# Altium project ADC_board.PrjPcb
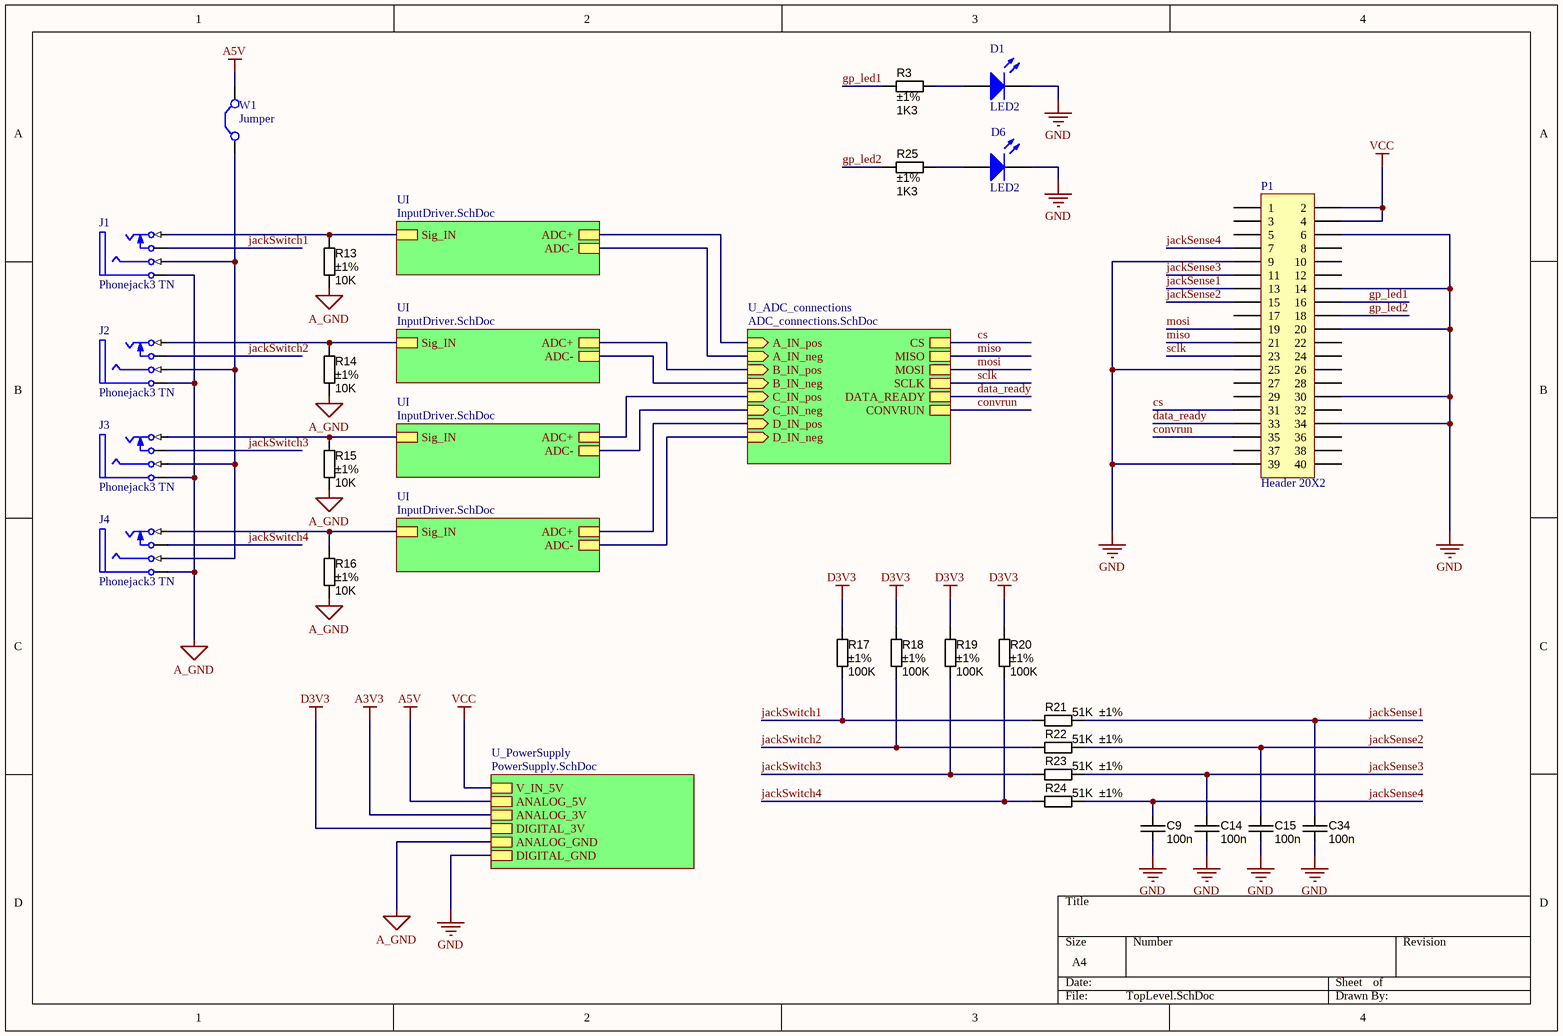
[diagram p0: TopLevel.SchDoc]
4 sheets, 106 parts. Net scope: hierarchical (ports join the sheet entries above them; power ports are global).
Board file: adc_pcb_board.PcbDoc
Sheets:
  TopLevel.SchDoc
    U_ADC_connections = ADC_connections.SchDoc
    UI = InputDriver.SchDoc
    UI = InputDriver.SchDoc
    UI = InputDriver.SchDoc
    UI = InputDriver.SchDoc
    U_PowerSupply = PowerSupply.SchDoc

## Sheet TopLevel.SchDoc
size A4

### Parts
C9  value 100n  [CAPC2012X135N]  (hidden comment: approved sub OK)
C14  value 100n  [CAPC2012X135N]  (hidden comment: approved sub OK)
C15  value 100n  [CAPC2012X135N]  (hidden comment: approved sub OK)
C34  value 100n  [CAPC2012X135N]  (hidden comment: approved sub OK)
D1  LED2  [3.2X1.6X1.1]
D6  LED2  [3.2X1.6X1.1]
J1  Phonejack3 TN  [SJ1-352XN Female Jack]
J2  Phonejack3 TN  [SJ1-352XN Female Jack]
J3  Phonejack3 TN  [SJ1-352XN Female Jack]
J4  Phonejack3 TN  [SJ1-352XN Female Jack]
P1  Header 20X2  [HDR2X20]
R3  value 1K3  Tolerance: ±1%  [RESC2012X70N]  (hidden comment: Thick Film)
R13  value 10K  Tolerance: ±1%  [RESC2012X70N]  (hidden comment: Thick Film)
R14  value 10K  Tolerance: ±1%  [RESC2012X70N]  (hidden comment: Thick Film)
R15  value 10K  Tolerance: ±1%  [RESC2012X70N]  (hidden comment: Thick Film)
R16  value 10K  Tolerance: ±1%  [RESC2012X70N]  (hidden comment: Thick Film)
R17  value 100K  Tolerance: ±1%  [RESC2012X70N]  (hidden comment: Thick Film)
R18  value 100K  Tolerance: ±1%  [RESC2012X70N]  (hidden comment: Thick Film)
R19  value 100K  Tolerance: ±1%  [RESC2012X70N]  (hidden comment: Thick Film)
R20  value 100K  Tolerance: ±1%  [RESC2012X70N]  (hidden comment: Thick Film)
R21  value 51K  Tolerance: ±1%  [RESC2012X70N]  (hidden comment: Thick Film)
R22  value 51K  Tolerance: ±1%  [RESC2012X70N]  (hidden comment: Thick Film)
R23  value 51K  Tolerance: ±1%  [RESC2012X70N]  (hidden comment: Thick Film)
R24  value 51K  Tolerance: ±1%  [RESC2012X70N]  (hidden comment: Thick Film)
R25  value 1K3  Tolerance: ±1%  [RESC2012X70N]  (hidden comment: Thick Film)
W1  Jumper  [HDR1X2]

### Sub-sheets
U_ADC_connections = ADC_connections.SchDoc: A_IN_pos (in), A_IN_neg (in), B_IN_pos (in), B_IN_neg (in), C_IN_pos (in), C_IN_neg (in), D_IN_pos (in), D_IN_neg (in), CS, MISO, MOSI, SCLK, DATA_READY, CONVRUN
U_PowerSupply = PowerSupply.SchDoc: V_IN_5V, ANALOG_5V, ANALOG_3V, DIGITAL_3V, ANALOG_GND, DIGITAL_GND
UI = InputDriver.SchDoc: Sig_IN, ADC+, ADC-
UI = InputDriver.SchDoc: Sig_IN, ADC+, ADC-
UI = InputDriver.SchDoc: Sig_IN, ADC+, ADC-
UI = InputDriver.SchDoc: Sig_IN, ADC+, ADC-

### Nets
A5V: P1.2 P1.4 W1.2(C2) ; sheet U_PowerSupply/V_IN_5V, sheet U_PowerSupply/ANALOG_5V  [also labelled VCC]
A_GND: J1.5(S) J2.5(S) J3.5(S) J4.5(S) R13.2 R14.2 R15.2 R16.2 ; sheet U_PowerSupply/ANALOG_GND
D3V3: R17.1 R18.1 R19.1 R20.1 ; sheet U_PowerSupply/DIGITAL_3V
GND: C9.2 C14.2 C15.2 C34.2 D1.2(K) D6.2(K) P1.6 P1.9 P1.14 P1.20 P1.25 P1.30 P1.34 P1.39 ; sheet U_PowerSupply/DIGITAL_GND
ADC_IN_N: sheet U_ADC_connections/B_IN_neg, sheet UI/ADC-
ADC_IN_N: sheet U_ADC_connections/A_IN_neg, sheet UI/ADC-  [a separate net that carries the same name]
ADC_IN_N: sheet U_ADC_connections/C_IN_neg, sheet UI/ADC-  [a separate net that carries the same name]
ADC_IN_N: sheet U_ADC_connections/D_IN_neg, sheet UI/ADC-  [a separate net that carries the same name]
ADC_IN_P: sheet U_ADC_connections/A_IN_pos, sheet UI/ADC+
ADC_IN_P: sheet U_ADC_connections/B_IN_pos, sheet UI/ADC+  [a separate net that carries the same name]
ADC_IN_P: sheet U_ADC_connections/C_IN_pos, sheet UI/ADC+  [a separate net that carries the same name]
ADC_IN_P: sheet U_ADC_connections/D_IN_pos, sheet UI/ADC+  [a separate net that carries the same name]
convrun: P1.35 ; sheet U_ADC_connections/CONVRUN
cs: P1.31 ; sheet U_ADC_connections/CS
data_ready: P1.33 ; sheet U_ADC_connections/DATA_READY
gp_led1: P1.16 R3.1
gp_led2: P1.18 R25.1
jackSense1: C34.1 P1.13 R21.1
jackSense2: C15.1 P1.15 R22.1
jackSense3: C14.1 P1.11 R23.1
jackSense4: C9.1 P1.7 R24.1
jackSwitch1: J1.2(TN) R17.2 R21.2
jackSwitch2: J2.2(TN) R18.2 R22.2
jackSwitch3: J3.2(TN) R19.2 R23.2
jackSwitch4: J4.2(TN) R20.2 R24.2
miso: P1.21 ; sheet U_ADC_connections/MISO
mosi: P1.19 ; sheet U_ADC_connections/MOSI
sclk: P1.23 ; sheet U_ADC_connections/SCLK
NetD1_1: D1.1(A) R3.2
NetD6_1: D6.1(A) R25.2
NetJ1_1: J1.1(T) R13.1 ; sheet UI/Sig_IN
NetJ1_3: J1.3(R) J2.3(R) J3.3(R) J4.3(R) W1.1(C1)
NetJ2_1: J2.1(T) R14.1 ; sheet UI/Sig_IN
NetJ3_1: J3.1(T) R15.1 ; sheet UI/Sig_IN
NetJ4_1: J4.1(T) R16.1 ; sheet UI/Sig_IN

Not connected (* = marked no-connect by the designer): P1 1 3 5 8 10 12 17 22 24 26 27 28 29 32 36 37 38 40

### Library data of the parts
C9 C14 C15 C34 = CAPC_100n_0805_X7R_100V_10%: Capacitor SMD Cer 100nF 10% 100V X7R 0805; Manufacturer 1: TDK Corporation; Manufacturer Part Number 1: C2012X7R2A104K; Ratings: 100V; X7R; Material: ceramic; SCDType: undef; Package / Case: 0805; Tolerance: ±10%; Supplier 1: Digi-Key; Supplier Part Number 1: 445-1418-1-ND
D1 D6 = LED2: Typical RED, GREEN, YELLOW, AMBER GaAs LED; Published: 8-Jun-2000; LatestRevisionDate: 17-Jul-2002; LatestRevisionNote: Re-released for DXP Platform.; PackageVersion: Feb-2002; PackageReference: 3.2X1.6X1.1; Publisher: Altium Limited; PackageDescription: SM LED; 2 Flat Leads
J1-J4 = Phonejack3 TN: Jack Socket, 1/4" [6.5mm], Thru-Hole, Vertical, 3-Conductor with Tip closed & Ring open; pin to pad: 1>2 2>10 5>1; PackageDocument: 2003; PCB_Layout: Complies with manufacturer's recommendation.; DrillAndSlotSize: Corresponds to nominal value.; Published: 15-Jul-2004; DatasheetDocument: 2003; PackageReference: S1VS_SSB; Publisher: Altium Limited; ComponentLink1Description: Manufacturer Link; ComponentLink1URL: http://www.cliffuk.co.uk/
P1 = Header 20X2: Header, 20-Pin, Dual row; LatestRevisionDate: 17-Jul-2002; LatestRevisionNote: Re-released for DXP Platform.; Publisher: Altium Limited
R3 R25 = RES_1K3_0805_1%: Resistor SMD chip 1.3k Ohm 0.125W 1% 0805; Manufacturer 1: Vishay/Dale; Manufacturer Part Number 1: CRCW08051K30FKEA; Ratings: 1/8W; SCDType: spec; Package / Case: 0805 (2012 metric); Supplier 1: Digi-Key; Supplier Part Number 1: 541-1.30KCCT-ND
R13-R16 = RES_10K_0805_1%: Resistor SMD chip 10k Ohm 0.125W 1% 0805; Manufacturer 1: Vishay/Dale; Manufacturer Part Number 1: CRCW080510K0FKEA; Ratings: 1/8W; SCDType: spec; Package / Case: 0805 (2012 metric); Supplier 1: Digi-Key; Supplier Part Number 1: 541-10.0KCCT-ND; Material: Thick Film
R17-R20 = RES_100K_0805_1%: Resistor SMD chip 100k Ohm 0.125W 1% 0805; Manufacturer 1: Vishay/Dale; Manufacturer Part Number 1: CRCW0805100KFKEA; Ratings: 1/8W; SCDType: spec; Package / Case: 0805 (2012 metric); Supplier 1: Digi-Key; Supplier Part Number 1: 541-100KCCT-ND
R21-R24 = RES_51K_0805_1%: Resistor SMD chip 51k Ohm 0.125W 1% 0805; Manufacturer 1: Yageo; Manufacturer Part Number 1: RC0805FR-0751KL; Ratings: 1/8W; SCDType: spec; Package / Case: 0805 (2012 Metric); Supplier 1: Digi-Key; Supplier Part Number 1: 311-51.0KCRCT-ND
W1 = Jumper: Jumper Wire; Published: 24-Mar-1999; LatestRevisionDate: 17-Jul-2002; LatestRevisionNote: Re-released for DXP Platform.; PackageReference: RAD-0.2; Publisher: Altium Limited; PackageDescription: Radial Cap, Thru-Hole; 2 Leads; 0.2 in Pin Spacing

## Sheet ADC_connections.SchDoc
size A4
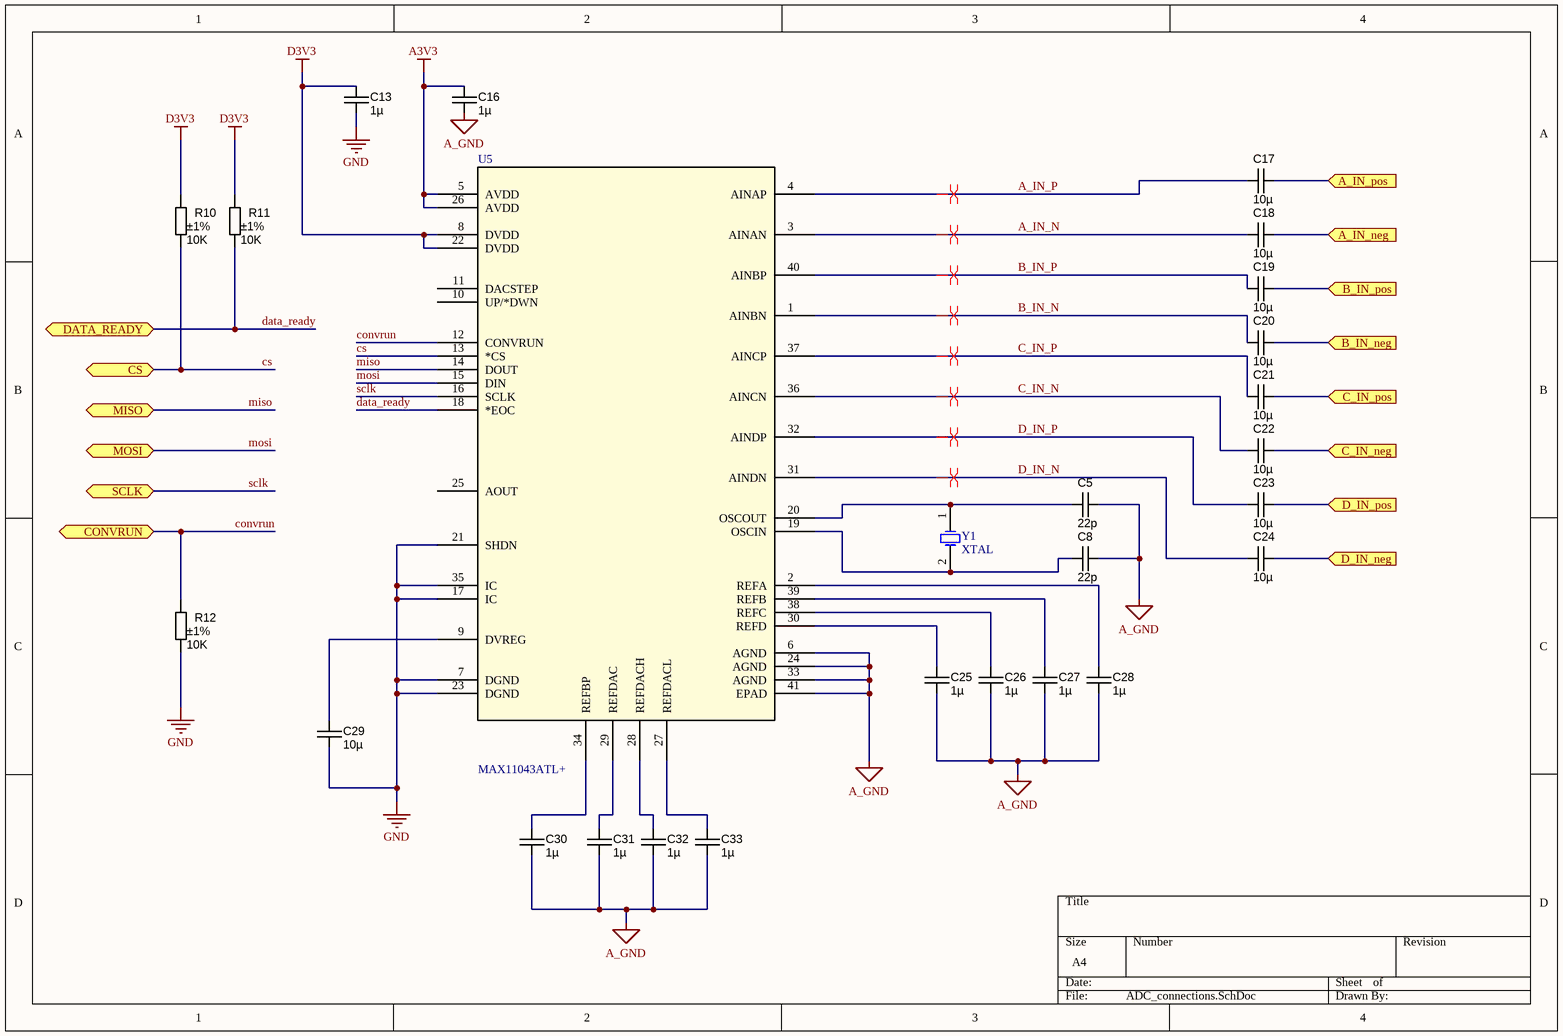
[diagram p1: ADC_connections.SchDoc]

### Parts
C5  value 22p  [CAPC2012X135N]  (hidden comment: approved sub OK)
C8  value 22p  [CAPC2012X135N]  (hidden comment: approved sub OK)
C13  value 1µ  [CAPC2012X135N]  (hidden comment: approved sub OK)
C16  value 1µ  [CAPC2012X135N]  (hidden comment: approved sub OK)
C17  value 10µ  [CAPC2012X135N]  (hidden comment: approved sub OK)
C18  value 10µ  [CAPC2012X135N]  (hidden comment: approved sub OK)
C19  value 10µ  [CAPC2012X135N]  (hidden comment: approved sub OK)
C20  value 10µ  [CAPC2012X135N]  (hidden comment: approved sub OK)
C21  value 10µ  [CAPC2012X135N]  (hidden comment: approved sub OK)
C22  value 10µ  [CAPC2012X135N]  (hidden comment: approved sub OK)
C23  value 10µ  [CAPC2012X135N]  (hidden comment: approved sub OK)
C24  value 10µ  [CAPC2012X135N]  (hidden comment: approved sub OK)
C25  value 1µ  [CAPC2012X135N]  (hidden comment: approved sub OK)
C26  value 1µ  [CAPC2012X135N]  (hidden comment: approved sub OK)
C27  value 1µ  [CAPC2012X135N]  (hidden comment: approved sub OK)
C28  value 1µ  [CAPC2012X135N]  (hidden comment: approved sub OK)
C29  value 10µ  [CAPC2012X135N]  (hidden comment: approved sub OK)
C30  value 1µ  [CAPC2012X135N]  (hidden comment: approved sub OK)
C31  value 1µ  [CAPC2012X135N]  (hidden comment: approved sub OK)
C32  value 1µ  [CAPC2012X135N]  (hidden comment: approved sub OK)
C33  value 1µ  [CAPC2012X135N]  (hidden comment: approved sub OK)
R10  value 10K  Tolerance: ±1%  [RESC2012X70N]  (hidden comment: Thick Film)
R11  value 10K  Tolerance: ±1%  [RESC2012X70N]  (hidden comment: Thick Film)
R12  value 10K  Tolerance: ±1%  [RESC2012X70N]  (hidden comment: Thick Film)
U5  MAX11043ATL+  [21-0141I_T4066-5]
Y1  XTAL  [Quartz Crystal HC-49USSX]

### Ports
A_IN_neg (in), A_IN_pos (in), B_IN_neg (in), B_IN_pos (in), C_IN_neg (in), C_IN_pos (in), CONVRUN, CS, D_IN_neg (in), D_IN_pos (in), DATA_READY, MISO, MOSI, SCLK

### Nets
A3V3: C16.1 U5.5(AVDD) U5.26(AVDD)
A_GND: C5.2 C8.2 C16.2 C25.2 C26.2 C27.2 C28.2 C30.2 C31.2 C32.2 C33.2 U5.6(AGND) U5.24(AGND) U5.33(AGND) U5.41(EPAD)
D3V3: C13.1 R10.1 R11.1 U5.8(DVDD) U5.22(DVDD)
GND: C13.2 C29.1 R12.2 U5.7(DGND) U5.17(IC) U5.21(SHDN) U5.23(DGND) U5.35(IC)
A_IN_N: C18.2 U5.3(AINAN)
A_IN_P: C17.2 U5.4(AINAP)
ADC_IN_N: C20.1 ; port B_IN_neg
ADC_IN_N: C18.1 ; port A_IN_neg  [a separate net that carries the same name]
ADC_IN_N: C22.2 ; port C_IN_neg  [a separate net that carries the same name]
ADC_IN_N: C24.2 ; port D_IN_neg  [a separate net that carries the same name]
ADC_IN_P: C17.1 ; port A_IN_pos
ADC_IN_P: C19.2 ; port B_IN_pos  [a separate net that carries the same name]
ADC_IN_P: C21.2 ; port C_IN_pos  [a separate net that carries the same name]
ADC_IN_P: C23.2 ; port D_IN_pos  [a separate net that carries the same name]
B_IN_N: C20.2 U5.1(AINBN)
B_IN_P: C19.1 U5.40(AINBP)
C_IN_N: C22.1 U5.36(AINCN)
C_IN_P: C21.1 U5.37(AINCP)
convrun: R12.1 U5.12(CONVRUN) ; port CONVRUN
cs: R10.2 U5.13(*CS) ; port CS
D_IN_N: C24.1 U5.31(AINDN)
D_IN_P: C23.1 U5.32(AINDP)
data_ready: R11.2 U5.18(*EOC) ; port DATA_READY
miso: U5.14(DOUT) ; port MISO
mosi: U5.15(DIN) ; port MOSI
sclk: U5.16(SCLK) ; port SCLK
NetC5_1: C5.1 U5.20(OSCOUT) Y1.1(OSC1)
NetC8_1: C8.1 U5.19(OSCIN) Y1.2(OSC2)
NetC25_1: C25.1 U5.30(REFD)
NetC26_1: C26.1 U5.38(REFC)
NetC27_1: C27.1 U5.39(REFB)
NetC28_1: C28.1 U5.2(REFA)
NetC29_2: C29.2 U5.9(DVREG)
NetC30_1: C30.1 U5.34(REFBP)
NetC31_1: C31.1 U5.29(REFDAC)
NetC32_1: C32.1 U5.28(REFDACH)
NetC33_1: C33.1 U5.27(REFDACL)

Not connected (* = marked no-connect by the designer): U5 10(UP/*DWN) 11(DACSTEP) 25(AOUT)

### Layout directives
differential pair: A_IN_N, A_IN_P, B_IN_N, B_IN_P, C_IN_N, C_IN_P, D_IN_N, D_IN_P

### Library data of the parts
C5 C8 = CAPC_27p_0805_NP0_50V_5%: Capacitor SMD Cer 22pF 5% 50V NP0 0805; Manufacturer 1: Panasonic - ECG; Manufacturer Part Number 1: ECJ-2VC1H270J; Ratings: 50V; NP0; SCDType: undef; Tolerance: ±5%; Operating Temperature: -55°C ~ 125°C; Package / Case: 0805 (2012 metric); Supplier 1: Digi-Key; Supplier Part Number 1: PCC270CGCT-ND
C13 C16 C25-C28 C30-C33 = CAPC_1u_0805_X7R_16V_10%: Capacitor SMD Cer 1uF 10% 16V X7R 0805; Manufacturer 1: Yageo; Manufacturer Part Number 1: CC0805KKX7R7BB105; Ratings: 16V; X7R; Material: ceramic; SCDType: spec; Package / Case: 0805 (2012 metric); Tolerance: ±10%; Supplier 1: Digi-Key; Supplier Part Number 1: 311-1365-6-ND; RoHS 1: RoHS Compliant; Temperature Coefficient: X7R; ComponentLink1URL: http://www.yageo.com/documents/recent/UPY-GPHC_X7R_6.3V-to-50V_8.pdf; ComponentLink1Description: http://www.yageo.com/documents/recent/UPY-GPHC_X7R_6.3V-to-50V_8.pdf; Supplier 2: Digi-Key; Supplier Part Number 2: 399-1284-6-ND; Manufacturer 2: Kemet; Manufacturer Part Number 2: C0805C105K4RACTU; RoHS 2: RoHS Compliant; ComponentLink2URL: http://www.kemet.com/datasheets&C0805C105K4RACTU; ComponentLink2Description: http://www.kemet.com/datasheets&C0805C105K4RACTU; Supplier 3: Digi-Key; Supplier Part Number 3: 1276-1026-6-ND; Manufacturer 3: Samsung Electro-Mechanics America, Inc; Manufacturer Part Number 3: CL21B105KOFNNNE; RoHS 3: RoHS Compliant; ComponentLink3URL: http://www.samsungsem.com/servlet/FileDownload?type=spec&file=CL21B105KOFNNNE.pdf; ComponentLink3Description: http://www.samsungsem.com/servlet/FileDownload?type=spec&file=CL21B105KOFNNNE.pdf; Supplier 4: Digi-Key; Supplier Part Number 4: 445-1358-6-ND; Manufacturer 4: TDK Corporation; Manufacturer Part Number 4: C2012X7R1C105K125AA; RoHS 4: RoHS Compliant; ComponentLink4URL: http://product.tdk.com/capacitor/mlcc/en/documents/mlcc_commercial_general_en.pdf; ComponentLink4Description: http://product.tdk.com/capacitor/mlcc/en/documents/mlcc_commercial_general_en.pdf
C17-C24 C29 = CAPC_10u_0805_10V: Capacitor SMD Cer 10uF 10% 10V X5R 0805; Manufacturer 1: AVX Corporation; Manufacturer Part Number 1: 0805ZD106KAT2A; Ratings: 10V; X5R; Material: ceramic; SCDType: spec; Package / Case: 0805 (2012 metric); Tolerance: ±10%; Manufacturer 2: Kemet; Manufacturer Part Number 2: C0805C106K8PACTU; Supplier 1: Digi-Key; Supplier Part Number 1: 478-5167-1-ND; ComponentLink1URL: http://www.avx.com/docs/Catalogs/cx5r.pdf; ComponentLink1Description: http://www.avx.com/docs/Catalogs/cx5r.pdf; ComponentLink2URL: http://www.kemet.com/datasheets&C0805C106K8PACTU; ComponentLink2Description: http://www.kemet.com/datasheets&C0805C106K8PACTU; Supplier 2: Digi-Key; Supplier Part Number 2: 399-4925-1-ND
R10-R12 = RES_10K_0805_1%: as R13 on sheet TopLevel; Package / Case: 0805 (2012 metric); Supplier 1: Digi-Key; Supplier Part Number 1: 541-10.0KCCT-ND; Material: Thick Film
U5 = MAX11043ATL+: Imported; Vendor: Maxim Integrated Products; Built_By: EMA_UL_Team; C: Copyright (C) 2015 Accelerated Designs. All rights reserved; Manufacturer_Part_Number: MAX11043ATL+; RefDes: RefDes; Type: DEV; Value: Value
Y1 = XTAL: Crystal Oscillator; Published: 8-Jun-2000; LatestRevisionDate: 17-Jul-2002; LatestRevisionNote: Re-released for DXP Platform.; PackageReference: R38; Publisher: Altium Limited; PackageDescription: Crystal, Thru-Hole; 2 Leads; Body 3.1 x 8.2 mm (Dia.xH)

## Sheet InputDriver.SchDoc
size A4
Used 4 times, as channels UI, UI, UI, UI. Parts and nets are listed once, with the designators drawn on the sheet.
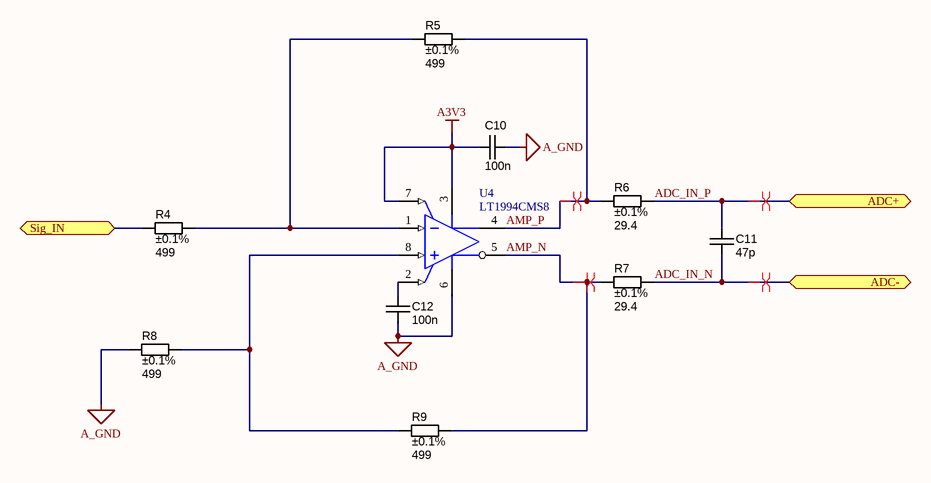
[diagram p2: InputDriver.SchDoc]

### Parts
C10  100n  [CAPC2012X135N]
C11  47p  [CAPC2012X135N]
C12  100n  [CAPC2012X135N]
R4  value 499  Tolerance: ±0.1%  [RESC2012X70N]  (hidden comment: Thick Film)
R5  value 499  Tolerance: ±0.1%  [RESC2012X70N]  (hidden comment: Thick Film)
R6  value 29.4  Tolerance: ±0.1%  [RESC2012X70N]  (hidden comment: Thick Film)
R7  value 29.4  Tolerance: ±0.1%  [RESC2012X70N]  (hidden comment: Thick Film)
R8  value 499  Tolerance: ±0.1%  [RESC2012X70N]  (hidden comment: Thick Film)
R9  value 499  Tolerance: ±0.1%  [RESC2012X70N]  (hidden comment: Thick Film)
U4  LT1994CMS8  [LT-MS8-8_N]

### Ports
ADC+, ADC-, Sig_IN

### Nets
A3V3: C10.1 U4.3(V+) U4.7(~{SHDN})
A_GND: C10.2 C12.2 R8.1 U4.6(V-)
ADC_IN_N: C11.2 R7.2 ; port ADC-
ADC_IN_P: C11.1 R6.2 ; port ADC+
AMP_N: R7.1 R9.2 U4.5(OUT-)
AMP_P: R5.2 R6.1 U4.4(OUT+)
Sig_IN: R4.1 ; port Sig_IN
NetC12_1: C12.1 U4.2(VOCM)
NetR4_2: R4.2 R5.1 U4.1(IN-)
NetR8_2: R8.2 R9.1 U4.8(IN+)

### Channels
UI: designators end in _UI4; ports ADC+=ADC_IN_P ADC-=ADC_IN_N Sig_IN=NetJ1_1
UI: designators end in _UI3; ports ADC+=ADC_IN_P ADC-=ADC_IN_N Sig_IN=NetJ2_1
UI: designators end in _UI2; ports ADC+=ADC_IN_P ADC-=ADC_IN_N Sig_IN=NetJ3_1
UI: designators end in _UI1; ports ADC+=ADC_IN_P ADC-=ADC_IN_N Sig_IN=NetJ4_1

### Layout directives
differential pair: ADC_IN_N, ADC_IN_P, AMP_N_UI, AMP_P_UI

### Library data of the parts
C10 C12 = CAPC_100n_0402_X5R_16V_10%: Capacitor SMD Cer 100nF 10% 16V X5R 0402; Manufacturer 1: AVX Corporation; Manufacturer Part Number 1: 0402YD104KAT2A; Ratings: 16V; X5R; SCDType: spec; Tolerance: ±10%; Operating Temperature: -55°C ~ 125°C; Package / Case: 0402 (1005 Metric); Size / Dimension: 0.039" L x 0.020" W (1.00mm x 0.50mm); Supplier 1: Digi-Key; Supplier Part Number 1: 478-1126-1-ND; ComponentLink1URL: http://www.avx.com/docs/Catalogs/cx5r.pdf; ComponentLink1Description: http://www.avx.com/docs/Catalogs/cx5r.pdf; Supplier 2: Digi-Key; Supplier Part Number 2: 311-1347-1-ND; Manufacturer 2: Yageo; Manufacturer Part Number 2: CC0402KRX5R7BB104; ComponentLink2URL: http://www.yageo.com/documents/recent/UPY-GPHC_X5R_4V-to-50V_12.pdf; ComponentLink2Description: http://www.yageo.com/documents/recent/UPY-GPHC_X5R_4V-to-50V_12.pdf; Value: 100n
C11 = CAPC_39p_0603_NP0_50V_1%: Capacitor SMD Cer 39pF 1% 50V NP0 0603; Manufacturer 1: AVX Corporation; Manufacturer Part Number 1: 06035A390FAT; Ratings: 50V; NP0; SCDType: source; Temperature Coefficient: C0G, NP0; Tolerance: ±1%; Operating Temperature: -55°C ~ 125°C; Package / Case: 0603 (1608 Metric); Supplier 1: Digi-Key; Supplier Part Number 1: 478-7918-6-ND; RoHS 1: RoHS Compliant; ComponentLink1URL: http://www.avx.com/docs/Catalogs/ccog.pdf; ComponentLink1Description: http://www.avx.com/docs/Catalogs/ccog.pdf; Supplier 2: Digi-Key; Supplier Part Number 2: 399-7909-6-ND; Manufacturer 2: Kemet; Manufacturer Part Number 2: C0603C390F5GACTU; RoHS 2: RoHS Compliant; ComponentLink2URL: http://www.kemet.com/datasheets&C0603C390F5GACTU; ComponentLink2Description: http://www.kemet.com/datasheets&C0603C390F5GACTU; Supplier 3: Digi-Key; Supplier Part Number 3: GRM1885C1H390FA01D-ND; Manufacturer 3: Murata Electronics North America; Manufacturer Part Number 3: GRM1885C1H390FA01; RoHS 3: RoHS Compliant; ComponentLink3URL: http://search.murata.co.jp/Ceramy/image/img/A01X/G101/ENG/GRM1885C1H390FA01-01.pdf; ComponentLink3Description: http://search.murata.co.jp/Ceramy/image/img/A01X/G101/ENG/GRM1885C1H390FA01-01.pdf; Value: 47p
R4-R9 = RES_1K_0805_1%: Resistor SMD chip 1k Ohm 0.125W 1% 0805; Manufacturer 1: Vishay/Dale; Manufacturer Part Number 1: CRCW08051K00FKEA; Ratings: 1/8W; SCDType: spec; Supplier 1: Digi-Key; Supplier Part Number 1: 541-1.00KCCT-ND; Package / Case: 0805 (2012 metric)
U4 = LT1994CMS8: Single Channel, Low Noise, Low Distortion Fully Differential Input / Output Amplifier / Driver, 70 MHz Typical GBW, 65 V/us Typical SR, 2.375 to 12.6 V, 8-Pin SOP (MS8-8), Commercial; Linear Technology Part Number: LT1994; Manufacturer: Linear Technology; Channels (#): 1; GBW (MHz) Typical: 70; Is (mA) Typical: 13.3; SR (V/us) Typical: 65; Vos (mV) Guaranteed: 2; Vs Max (V): 12.6; Vs Min (V): 2.375; DatasheetVersion: Rev. B; PackageVersion: Rev G; PackageReference: LT-MS8-8; PackageDescription: 8-Lead Plastic Small Outline, Body 3.9 x 4.9 mm, Pitch 1.27 mm; Type: DIFF; Vos (mV) Typical: 2; Mounting Technology: Surface Mount; PartNumber: LT1994CMS8; ComponentLink1Description: Manufacturer URL; ComponentLink1URL: http://www.linear.com/; ComponentLink2Description: Datasheet; ComponentLink2URL: http://cds.linear.com/docs/en/datasheet/1994fb.pdf; ComponentLink3Description: Package Specification; ComponentLink3URL: http://cds.linear.com/docs/en/packaging/05081610_G_SO8.pdf

## Sheet PowerSupply.SchDoc
size A4
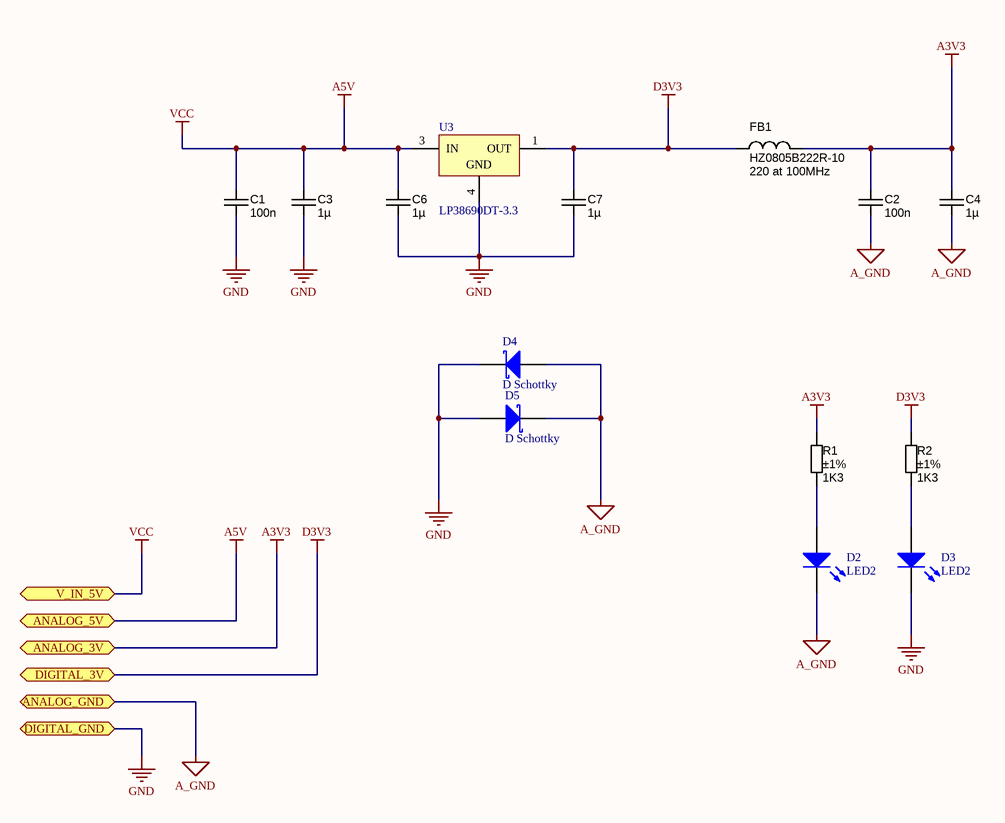
[diagram p3: PowerSupply.SchDoc]

### Parts
C1  value 100n  [CAPC2012X135N]  (hidden comment: approved sub OK)
C2  value 100n  [CAPC2012X135N]  (hidden comment: approved sub OK)
C3  value 1µ  [CAPC2012X135N]  (hidden comment: approved sub OK)
C4  value 1µ  [CAPC2012X135N]  (hidden comment: approved sub OK)
C6  value 1µ  [CAPC2012X135N]  (hidden comment: approved sub OK)
C7  value 1µ  [CAPC2012X135N]  (hidden comment: approved sub OK)
D2  LED2  [3.2X1.6X1.1]
D3  LED2  [3.2X1.6X1.1]
D4  D Schottky  [LED-0805-A]
D5  D Schottky  [LED-0805-A]
FB1  Manufacturer Part Number 1: HZ0805B222R-10  [FBC2012N]  (hidden comment: 220 at 100MHz)
R1  value 1K3  Tolerance: ±1%  [RESC2012X70N]  (hidden comment: Thick Film)
R2  value 1K3  Tolerance: ±1%  [RESC2012X70N]  (hidden comment: Thick Film)
U3  LP38690DT-3.3  [TD03B_N]

### Ports
ANALOG_3V, ANALOG_5V, ANALOG_GND, DIGITAL_3V, DIGITAL_GND, V_IN_5V

### Nets
A3V3: C2.1 C4.1 FB1.2 R1.1 ; port ANALOG_3V
A5V: C1.1 C3.1 C6.1 U3.3(IN) ; port V_IN_5V, port ANALOG_5V  [also labelled VCC]
A_GND: C2.2 C4.2 D2.2(K) D4.1(A) D5.2(K) ; port ANALOG_GND
D3V3: C7.1 FB1.1 R2.1 U3.1(OUT) ; port DIGITAL_3V
GND: C1.2 C3.2 C6.2 C7.2 D3.2(K) D4.2(K) D5.1(A) U3.4(GND) ; port DIGITAL_GND
NetD2_1: D2.1(A) R1.2
NetD3_1: D3.1(A) R2.2

### Library data of the parts
C1 C2 = CAPC_100n_0805_X7R_50V_10%: Capacitor SMD Cer 100nF 10% 50V X7R 0805; Manufacturer 1: Kemet; Manufacturer Part Number 1: C0805C104K5RACTU; Ratings: 50V; X7R; Material: ceramic; SCDType: undef; Package / Case: 0805 (2012 metric); Tolerance: ±10%; Supplier 1: Digi-Key; Supplier Part Number 1: 399-1170-1-ND
C3 C4 C6 C7 = CAPC_1u_0805_X7R_16V_10%: as C13 on sheet ADC_connections; Package / Case: 0805 (2012 metric); Tolerance: ±10%; Supplier 1: Digi-Key; Supplier Part Number 1: 311-1365-6-ND; RoHS 1: RoHS Compliant; Temperature Coefficient: X7R; ComponentLink1URL: http://www.yageo.com/documents/recent/UPY-GPHC_X7R_6.3V-to-50V_8.pdf; ComponentLink1Description: http://www.yageo.com/documents/recent/UPY-GPHC_X7R_6.3V-to-50V_8.pdf; Supplier 2: Digi-Key; Supplier Part Number 2: 399-1284-6-ND; Manufacturer 2: Kemet; Manufacturer Part Number 2: C0805C105K4RACTU; RoHS 2: RoHS Compliant; ComponentLink2URL: http://www.kemet.com/datasheets&C0805C105K4RACTU; ComponentLink2Description: http://www.kemet.com/datasheets&C0805C105K4RACTU; Supplier 3: Digi-Key; Supplier Part Number 3: 1276-1026-6-ND; Manufacturer 3: Samsung Electro-Mechanics America, Inc; Manufacturer Part Number 3: CL21B105KOFNNNE; RoHS 3: RoHS Compliant; ComponentLink3URL: http://www.samsungsem.com/servlet/FileDownload?type=spec&file=CL21B105KOFNNNE.pdf; ComponentLink3Description: http://www.samsungsem.com/servlet/FileDownload?type=spec&file=CL21B105KOFNNNE.pdf; Supplier 4: Digi-Key; Supplier Part Number 4: 445-1358-6-ND; Manufacturer 4: TDK Corporation; Manufacturer Part Number 4: C2012X7R1C105K125AA; RoHS 4: RoHS Compliant; ComponentLink4URL: http://product.tdk.com/capacitor/mlcc/en/documents/mlcc_commercial_general_en.pdf; ComponentLink4Description: http://product.tdk.com/capacitor/mlcc/en/documents/mlcc_commercial_general_en.pdf
D2 D3 = LED2: as D1 on sheet TopLevel; Published: 8-Jun-2000; LatestRevisionDate: 17-Jul-2002; LatestRevisionNote: Re-released for DXP Platform.; PackageVersion: Feb-2002; PackageReference: 3.2X1.6X1.1; Publisher: Altium Limited; PackageDescription: SM LED; 2 Flat Leads
D4 D5 = D Schottky: Schottky Diode; pin to pad: 1>A 2>K; Published: 8-Jun-2000; LatestRevisionDate: 17-Jul-2002; LatestRevisionNote: Re-released for DXP Platform.; PackageReference: SMB; Publisher: Altium Limited; PackageDescription: DO-214-AA/SMB; 2 C-Bend Leads; Body 5.3 x 3.6 mm, inc. leads (LxW); Code_JEDEC: DO-214-AA
FB1 = FERRITE_2K2-100MHz_0805: Ferrite bead BLM21PG221SN1D 220 ohm at 100MHz 2A; Manufacturer 1: Laird-Signal Integrity Products; Ratings: 200 mA; 800 mOhm DC; Impedance @ Frequency: 600 Ohm @ 100MHz; Current Rating: 200mA; DC Resistance (DCR): 800 mOhm Max; Filter Type: Differential Mode - Single; SCDType: source; Size / Dimension: 0.063" L x 0.031" W (1.60mm x 0.80mm); Package / Case: 0805 (2012 Metric); Height (Max): 0.043" (1.09mm); ComponentLink1URL: http://www.lairdtech.com/WorkArea/linkit.aspx?LinkIdentifier=id&ItemID=4879; ComponentLink1Description: http://www.lairdtech.com/WorkArea/linkit.aspx?LinkIdentifier=id&ItemID=4879; Supplier 1: Digi-Key; Supplier Part Number 1: 240-2562-1-ND; Mounting Type: Surface Mount; Value: 220 at 100MHz
R1 R2 = RES_1K3_0805_1%: as R3 on sheet TopLevel; Package / Case: 0805 (2012 metric); Supplier 1: Digi-Key; Supplier Part Number 1: 541-1.30KCCT-ND
U3 = LP38690DT-3.3: 1A Low Dropout CMOS Linear Regulators, 3-pin TO-252; Manufacturer: National Semiconductor; PackageTopMarking: NSUZXYTT*LP38690*DT-3.3; PowerWise: Y; CompType: LDO IC; DatasheetVersion: May-2005; PackageVersion: revD, Feb-2009; PackageReference: TD03B; PackageDescription: TO252, Molded, Jedec, 6.8 x 6.10 x 2.30mm Body, 3 Lead, 2.28mm Pitch, Surface Mount; PartNumber: LP38690DT-3.3; RoHS: N; PinCount: 3; High-Reliability: Y; Code_JEDEC: TO-252-AA; ComponentLink1Description: Manufacturer URL; ComponentLink1URL: http://www.national.com/; ComponentLink2Description: LP38690 Datasheet; ComponentLink2URL: http://www.national.com/ds/LP/LP38690.pdf; ComponentLink3Description: LP38690 Web Page; ComponentLink3URL: http://www.national.com/pf/LP/LP38690.html; ComponentLink4Description: TD03B Package Page; ComponentLink4URL: http://www.national.com/packaging/folders/td03b.html

## Nets that join several sheets
A3V3: ADC_connections (C16.1 U5.5 U5.26), UI (C10_UI4.1 U4_UI4.3 U4_UI4.7), UI (C10_UI3.1 U4_UI3.3 U4_UI3.7), UI (C10_UI2.1 U4_UI2.3 U4_UI2.7), UI (C10_UI1.1 U4_UI1.3 U4_UI1.7), PowerSupply (C2.1 C4.1 FB1.2 R1.1)
A5V: TopLevel (P1.2 P1.4 W1.2), PowerSupply (C1.1 C3.1 C6.1 U3.3)
A_GND: TopLevel (8 pins), ADC_connections (15 pins), UI (C10_UI4.2 C12_UI4.2 R8_UI4.1 U4_UI4.6), UI (C10_UI3.2 C12_UI3.2 R8_UI3.1 U4_UI3.6), UI (C10_UI2.2 C12_UI2.2 R8_UI2.1 U4_UI2.6), UI (C10_UI1.2 C12_UI1.2 R8_UI1.1 U4_UI1.6), PowerSupply (5 pins)
D3V3: TopLevel (R17.1 R18.1 R19.1 R20.1), ADC_connections (5 pins), PowerSupply (C7.1 FB1.1 R2.1 U3.1)
GND: TopLevel (14 pins), ADC_connections (8 pins), PowerSupply (8 pins)
ADC_IN_N: ADC_connections (C20.1), UI (C11_UI3.2 R7_UI3.2)
ADC_IN_N: ADC_connections (C18.1), UI (C11_UI4.2 R7_UI4.2)
ADC_IN_N: ADC_connections (C22.2), UI (C11_UI2.2 R7_UI2.2)
ADC_IN_N: ADC_connections (C24.2), UI (C11_UI1.2 R7_UI1.2)
ADC_IN_P: ADC_connections (C17.1), UI (C11_UI4.1 R6_UI4.2)
ADC_IN_P: ADC_connections (C19.2), UI (C11_UI3.1 R6_UI3.2)
ADC_IN_P: ADC_connections (C21.2), UI (C11_UI2.1 R6_UI2.2)
ADC_IN_P: ADC_connections (C23.2), UI (C11_UI1.1 R6_UI1.2)
convrun: TopLevel (P1.35), ADC_connections (R12.1 U5.12)
cs: TopLevel (P1.31), ADC_connections (R10.2 U5.13)
data_ready: TopLevel (P1.33), ADC_connections (R11.2 U5.18)
miso: TopLevel (P1.21), ADC_connections (U5.14)
mosi: TopLevel (P1.19), ADC_connections (U5.15)
NetJ1_1: TopLevel (J1.1 R13.1), UI (R4_UI4.1)
NetJ2_1: TopLevel (J2.1 R14.1), UI (R4_UI3.1)
NetJ3_1: TopLevel (J3.1 R15.1), UI (R4_UI2.1)
NetJ4_1: TopLevel (J4.1 R16.1), UI (R4_UI1.1)
sclk: TopLevel (P1.23), ADC_connections (U5.16)